# EAGLE design controller3 (EAGLE 6.3)
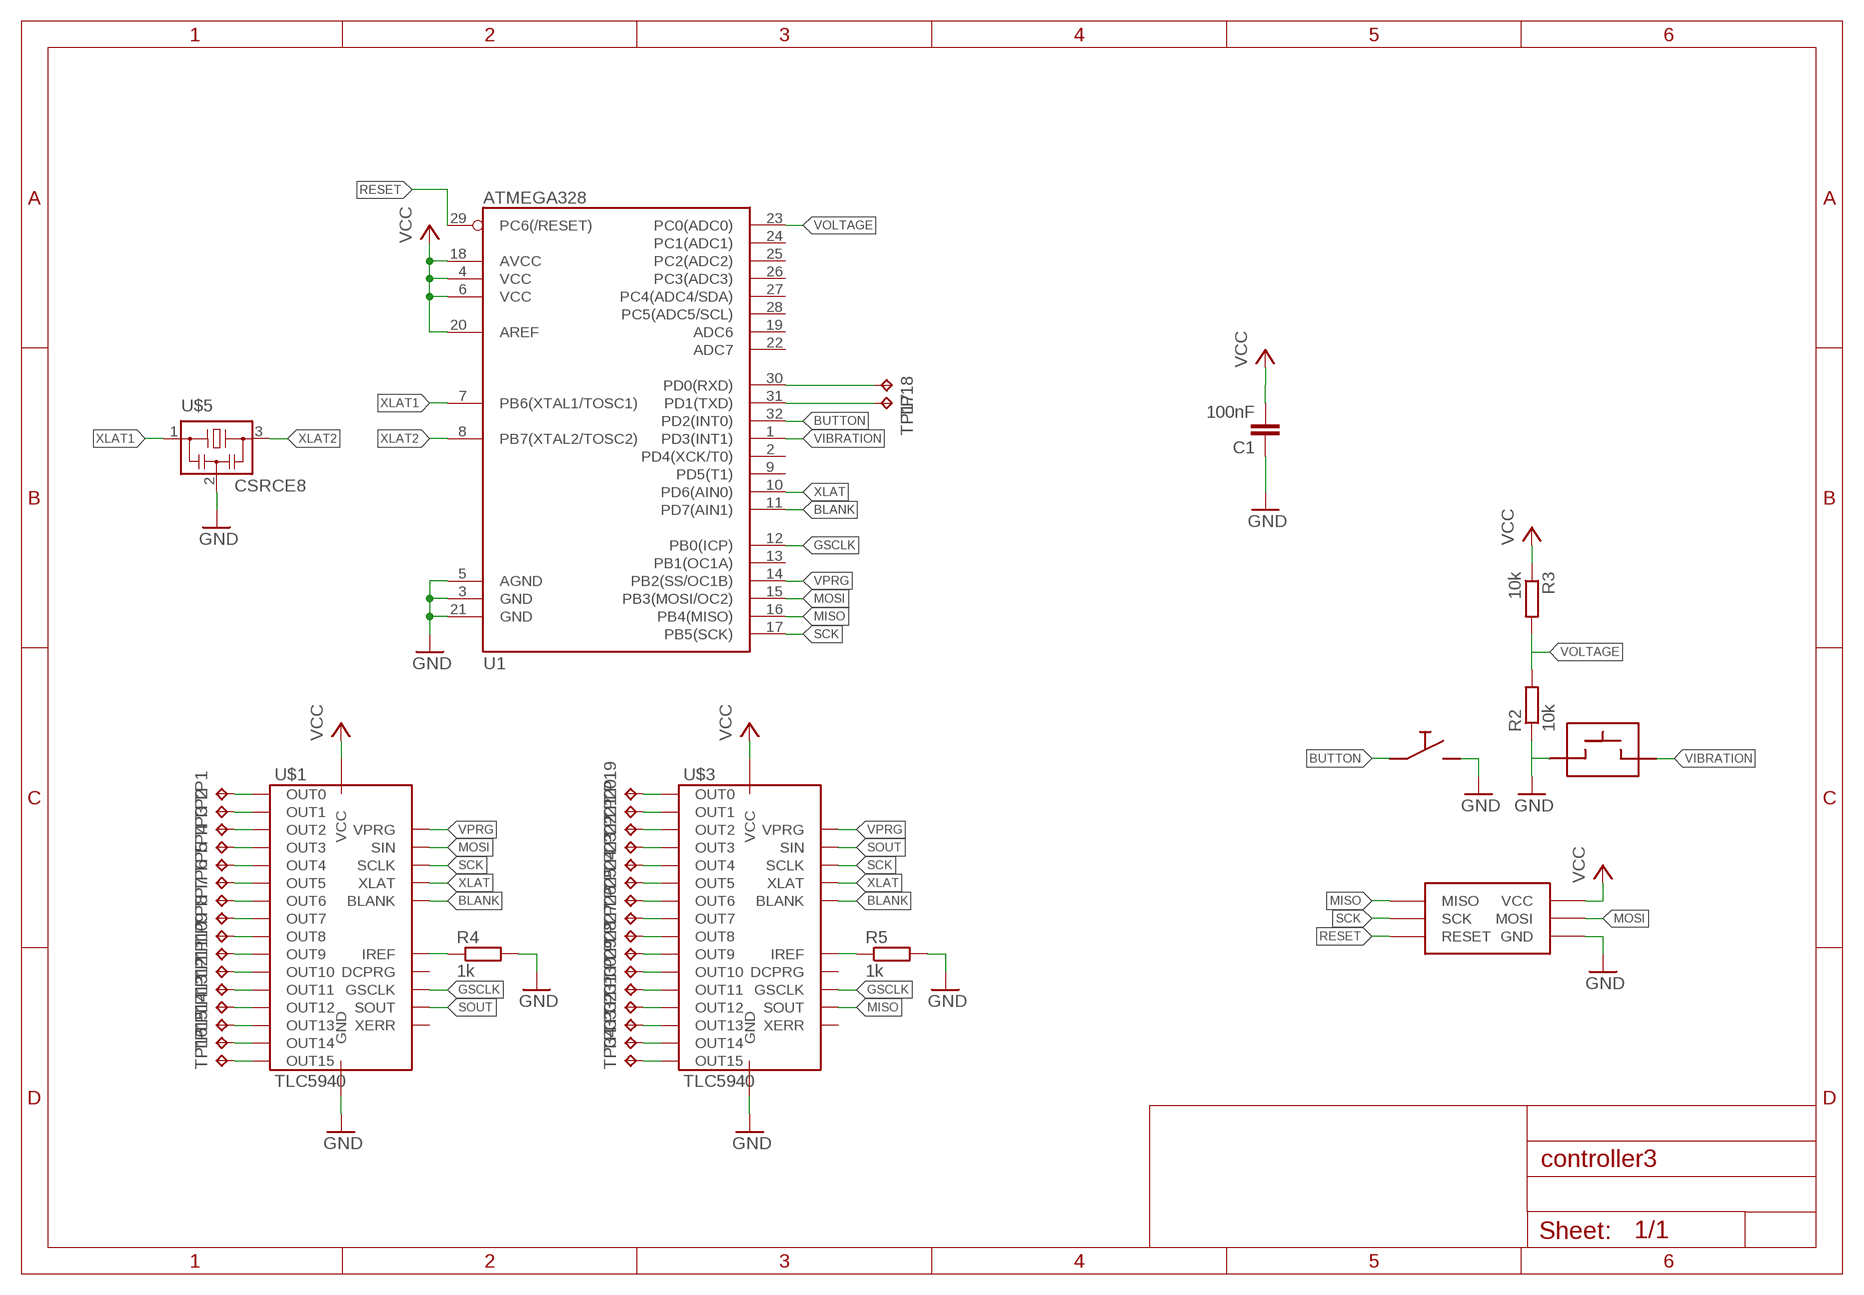
[diagram p0: schematic, sheet 1]

## Parts
C1  100nF  C-EUC0603  [C0603]
R2  10k  R-EU_R0603  [R0603]
R3  10k  R-EU_R0603  [R0603]
R4  1k  R-EU_R0603  [R0603]
R5  1k  R-EU_R0603  [R0603]
TP1  TPTP15SQ  [TP15SQ]
TP2  TPTP15SQ  [TP15SQ]
TP3  TPTP15SQ  [TP15SQ]
TP4  TPTP15SQ  [TP15SQ]
TP5  TPTP15SQ  [TP15SQ]
TP6  TPTP15SQ  [TP15SQ]
TP7  TPTP15SQ  [TP15SQ]
TP8  TPTP15SQ  [TP15SQ]
TP9  TPTP15SQ  [TP15SQ]
TP10  TPTP15SQ  [TP15SQ]
TP11  TPTP15SQ  [TP15SQ]
TP12  TPTP15SQ  [TP15SQ]
TP13  TPTP15SQ  [TP15SQ]
TP14  TPTP15SQ  [TP15SQ]
TP15  TPTP15SQ  [TP15SQ]
TP16  TPTP15SQ  [TP15SQ]
TP17  TPTP15SQ  [TP15SQ]
TP18  TPTP15SQ  [TP15SQ]
TP19  TPTP15SQ  [TP15SQ]
TP20  TPTP15SQ  [TP15SQ]
TP21  TPTP15SQ  [TP15SQ]
TP22  TPTP15SQ  [TP15SQ]
TP23  TPTP15SQ  [TP15SQ]
TP24  TPTP15SQ  [TP15SQ]
TP25  TPTP15SQ  [TP15SQ]
TP26  TPTP15SQ  [TP15SQ]
TP27  TPTP15SQ  [TP15SQ]
TP28  TPTP15SQ  [TP15SQ]
TP29  TPTP15SQ  [TP15SQ]
TP30  TPTP15SQ  [TP15SQ]
TP31  TPTP15SQ  [TP15SQ]
TP32  TPTP15SQ  [TP15SQ]
TP33  TPTP15SQ  [TP15SQ]
TP34  TPTP15SQ  [TP15SQ]
U1  ATMEGA328  [TQFP32-08]
U$1  TLC5940  [PWP_28PIN]
U$2  ISP_SPECIALS  [ISP_RM2_00_STRAIGHT]
U$3  TLC5940  [PWP_28PIN]
U$4  MOTION_SENSOR  [MOTION]
U$5  CSRCE8  [CSTCE_G]
U$6  SWITCH  [EVQPSG02K]

## Nets
BLANK: U1.11(PD7(AIN1)) U$1.P2(BLANK) U$3.P2(BLANK)
BUTTON: U1.32(PD2(INT0)) U$6.A U$6.A@2
GND: C1.1 R2.1 R4.2 R5.2 U1.3(GND) U1.5(AGND) U1.21(GND) U$1.P1(GND) U$1.P29(GND) U$2.VCC(GND) U$3.P1(GND) U$3.P29(GND) U$4.P$1(IN) U$5.2 U$6.B U$6.B@2
GSCLK: U1.12(PB0(ICP)) U$1.P25(GSCLK) U$3.P25(GSCLK)
MISO: U1.16(PB4(MISO)) U$2.RESET(MISO) U$3.P24(SOUT)
MOSI: U1.15(PB3(MOSI/OC2)) U$1.P5(SIN) U$2.MOSI
N$1: TP1.TP U$1.P7(OUT0)
N$2: TP2.TP U$1.P8(OUT1)
N$3: TP3.TP U$1.P9(OUT2)
N$5: TP4.TP U$1.P10(OUT3)
N$6: TP5.TP U$1.P11(OUT4)
N$7: TP6.TP U$1.P12(OUT5)
N$8: R4.1 U$1.P27(IREF)
N$9: TP7.TP U$1.P13(OUT6)
N$10: TP8.TP U$1.P14(OUT7)
N$11: TP9.TP U$1.P15(OUT8)
N$12: TP10.TP U$1.P16(OUT9)
N$13: TP11.TP U$1.P17(OUT10)
N$14: TP12.TP U$1.P18(OUT11)
N$15: TP13.TP U$1.P19(OUT12)
N$16: TP14.TP U$1.P20(OUT13)
N$17: TP15.TP U$1.P21(OUT14)
N$18: TP16.TP U$1.P22(OUT15)
N$19: R5.1 U$3.P27(IREF)
N$20: TP19.TP U$3.P7(OUT0)
N$21: TP20.TP U$3.P8(OUT1)
N$24: TP21.TP U$3.P9(OUT2)
N$25: TP22.TP U$3.P10(OUT3)
N$26: TP23.TP U$3.P11(OUT4)
N$27: TP24.TP U$3.P12(OUT5)
N$28: TP25.TP U$3.P13(OUT6)
N$29: TP26.TP U$3.P14(OUT7)
N$30: TP27.TP U$3.P15(OUT8)
N$31: TP28.TP U$3.P16(OUT9)
N$32: TP29.TP U$3.P17(OUT10)
N$33: TP30.TP U$3.P18(OUT11)
N$34: TP31.TP U$3.P19(OUT12)
N$35: TP32.TP U$3.P20(OUT13)
N$36: TP33.TP U$3.P21(OUT14)
N$37: TP34.TP U$3.P22(OUT15)
RESET: U1.29(PC6(/RESET)) U$2.MISO(RESET)
RX: TP18.TP U1.30(PD0(RXD))
SCK: U1.17(PB5(SCK)) U$1.P4(SCLK) U$2.SCK U$3.P4(SCLK)
SOUT: U$1.P24(SOUT) U$3.P5(SIN)
TX: TP17.TP U1.31(PD1(TXD))
VCC: C1.2 R3.1 U1.4(VCC) U1.6(VCC) U1.18(AVCC) U1.20(AREF) U$1.P28(VCC) U$2.GND(VCC) U$3.P28(VCC)
VIBRATION: U1.1(PD3(INT1)) U$4.P$2(OUT)
VOLTAGE: R2.2 R3.2 U1.23(PC0(ADC0))
VPRG: U1.14(PB2(SS/OC1B)) U$1.P6(VPRG) U$3.P6(VPRG)
XLAT: U1.10(PD6(AIN0)) U$1.P3(XLAT) U$3.P3(XLAT)
XLAT1: U1.7(PB6(XTAL1/TOSC1)) U$5.1
XLAT2: U1.8(PB7(XTAL2/TOSC2)) U$5.3
Unconnected: U1.2(PD4(XCK/T0)) U1.9(PD5(T1)) U1.13(PB1(OC1A)) U1.19(ADC6) U1.22(ADC7) U1.24(PC1(ADC1)) U1.25(PC2(ADC2)) U1.26(PC3(ADC3)) U1.27(PC4(ADC4/SDA)) U1.28(PC5(ADC5/SCL)) U$1.P23(XERR) U$1.P26(DCPRG) U$3.P23(XERR) U$3.P26(DCPRG)

## Library data of the parts
C1 = rcl:C-EU: CAPACITOR, European symbol
R2-R5 = rcl:R-EU_: RESISTOR, European symbol
TP1-TP34 = testpad:TP: Test pad
U1 = thecustomgeek:ATMEGA328: ATmega328P-AU TQFP 32 pin
U$1 U$3 = niklas:TLC5940
U$2 = bookla:ISP_SPECIAL
U$4 = bookla:MOTION_SENSOR
U$5 = bookla:CSRCE8
U$6 = bookla:SWITCH

## Board
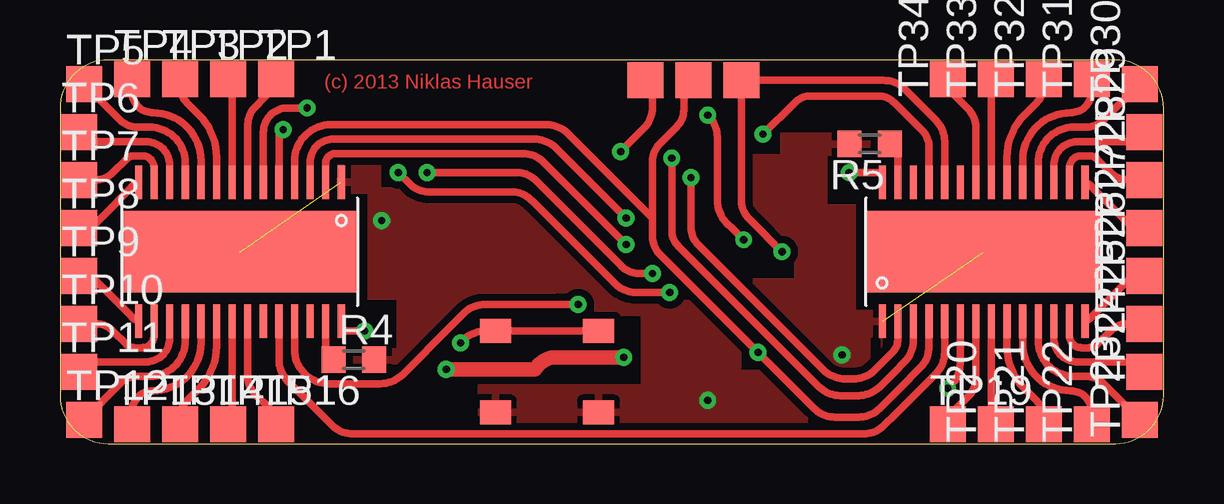
[diagram p1: board, top side]
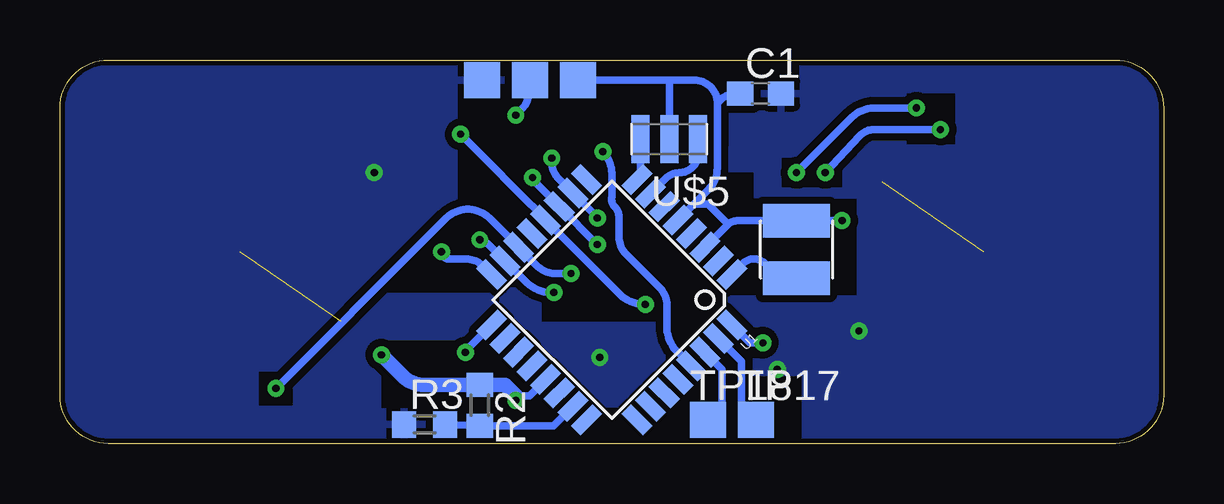
[diagram p2: board, bottom side, seen from below]

Size 46 x 16 mm. Coordinates in mm from the lower left corner, seen from the top.
Outline: 0,14 0,2 arc90 2,0 44,0 arc90 46,2 46,14 arc90 44,16 2,16 arc90 0,14
Copper layers (1*16): Top 0.035mm / dielectric 1.5mm / Bottom 0.035mm
Design rules "default *": minimum track width 10mil, minimum drill 24mil, track to track 12mil, track to pad 10mil, pad to pad 8mil, via to via 8mil, smd to smd 8mil, copper to edge 8mil, drill to drill 8mil, minimum pad ring 10mil, minimum via ring 8mil, stop-mask expansion 4mil, vias tented up to drill 0mil, thermal gap 10mil
tRestrict: area 33.2,5.6 to 43.5,10.4; area 2.4,5.6 to 12.8,10.4; area 32,10 to 34,12; area 30,13 to 35,14; area 11,4 to 14,6; area 14.4,2.5 to 21,3.3; area 21,2.5 to 24.2,5.3; area 28.1,6.9 to 30.6,8.2; area 16.9,0.8 to 17.4,2.6; area 28.7,12.1 to 30,13.5; area 13.4,10.7 to 15.9,11.9; area 28.4,3.1 to 29.6,4.3; 2 more areas
bRestrict: area 27.3,3 to 28.8,4.2; area 28.6,3.1 to 32.6,4.3; area 27.6,13 to 29.4,14.4; area 29.1,10.1 to 29.4,12.5; area 19.1,10 to 21,11.2; area 12.8,6.2 to 18.1,10.2; area 22.5,1.1 to 23.8,1.5; area 31.1,1.5 to 32.6,3.1; area 27.4,6.3 to 32.4,7.4; area 21.2,5.1 to 25.9,6.2; area 15.2,15.1 to 16.4,15.8; area 17.1,10 to 18.8,11.3; 4 more areas

### Footprints (pad centres in the part's own frame; a part is rotated, then mirrored left to right if it is on the bottom)
C0603 = smd 1.1 x 1: 1 -0.85,0; 2 0.85,0
R0603 = smd 1 x 1.1: 1 -0.85,0; 2 0.85,0
TP15SQ = smd 1.5 x 1.5: TP 0,0
TQFP32-08 = smd 1.27 x 0.559: 1 -4.293,2.8; 2 -4.293,2; 3 -4.293,1.2; 4 -4.293,0.4; 5 -4.293,-0.4; 6 -4.293,-1.2; 7 -4.293,-2; 8 -4.293,-2.8; 17 4.293,-2.8; 18 4.293,-2; 19 4.293,-1.2; 20 4.293,-0.4; 21 4.293,0.4; 22 4.293,1.2; 23 4.293,2; 24 4.293,2.8 | smd 0.559 x 1.27: 9 -2.8,-4.293; 10 -2,-4.293; 11 -1.2,-4.293; 12 -0.4,-4.293; 13 0.4,-4.293; 14 1.2,-4.293; 15 2,-4.293; 16 2.8,-4.293; 25 2.8,4.293; 26 2,4.293; 27 1.2,4.293; 28 0.4,4.293; 29 -0.4,4.293; 30 -1.2,4.293; 31 -2,4.293; 32 -2.8,4.293
PWP_28PIN = smd 0.3 x 1.4: P1 -4.225,-2.9; P2 -3.575,-2.9; P3 -2.925,-2.9; P4 -2.275,-2.9; P5 -1.625,-2.9; P6 -0.975,-2.9; P7 -0.325,-2.9; P8 0.325,-2.9; P9 0.975,-2.9; P10 1.625,-2.9; P11 2.275,-2.9; P12 2.925,-2.9; P13 3.575,-2.9; P14 4.225,-2.9; P15 4.225,2.9; P16 3.575,2.9; P17 2.925,2.9; P18 2.275,2.9; P19 1.625,2.9; P20 0.975,2.9; P21 0.325,2.9; P22 -0.325,2.9; P23 -0.975,2.9; P24 -1.625,2.9; P25 -2.275,2.9; P26 -2.925,2.9; P27 -3.575,2.9; P28 -4.225,2.9 | smd 9.7 x 3.4: P29 0,0
ISP_RM2_00_STRAIGHT = smd 1.5 x 1.5 bottom: GND 2,-0.85; MOSI 0,-0.85; VCC -2,-0.85 | smd 1.5 x 1.5: MISO -2,-0.85; RESET 2,-0.85; SCK 0,-0.85
MOTION = smd 1.4 x 2.8: P$1 -1.2,0; P$2 1.2,0
CSTCE_G = smd 0.75 x 2: 1 -1.2,0; 2 0,0; 3 1.2,0
EVQPSG02K = smd 1 x 1.3: A -1.7,2.15; A@2 -1.7,-2.15; B 1.7,2.15; B@2 1.7,-2.15

### Placement (x,y rotation side)
C1  16.8,14.6 0 bottom
R2  28.5,1.6 270 bottom
R3  30.8,0.8 0 bottom
R4  12.25,3.5 0 top
R5  33.75,12.5 180 top
TP1  9,15.2 0 top
TP2  7,15.2 0 top
TP3  5,15.2 0 top
TP4  3,15.2 0 top
TP5  1,15 0 top
TP6  0.8,13 0 top
TP7  0.8,11 0 top
TP8  0.8,9 0 top
TP9  0.8,7 0 top
TP10  0.8,5 0 top
TP11  0.8,3 0 top
TP12  1,1 0 top
TP13  3,0.8 0 top
TP14  5,0.8 0 top
TP15  7,0.8 0 top
TP16  9,0.8 0 top
TP17  17,1 0 bottom
TP18  19,1 0 bottom
TP19  37,0.8 0 top
TP20  39,0.8 90 top
TP21  41,0.8 90 top
TP22  43,0.8 90 top
TP23  45,1 90 top
TP24  45.2,3 90 top
TP25  45.2,5 90 top
TP26  45.2,7 90 top
TP27  45.2,9 90 top
TP28  45.2,11 90 top
TP29  45.2,13 90 top
TP30  45,15 90 top
TP31  43,15.2 90 top
TP32  41,15.2 90 top
TP33  39,15.2 90 top
TP34  37,15.2 90 top
U1  23,6 225 bottom
U$1  7.5,8 180 top
U$2  26.4,16 0 top
U$3  38.5,8 0 top
U$4  15.3,8.1 270 bottom
U$5  20.6,12.7 180 bottom
U$6  20.3,3 270 top

### Tracks (layer width: path | path; a pad name or v marks a point on that pad's centre or on a via)
BLANK  (via drill 0.3)
  Top 0.305: U$3.P2 34.92,4.34 arc-45 34.7,3.8 33.97,3.07 arc-45 33.07,2.7 33,2.7 32.73,2.7 arc-45 31.83,3.07 26.59,8.31 arc-45 26.3,9.01 v26.3,11.1 | U$1.P2 11.07,11.68 arc-90 11.5,12.1 19.27,12.1 arc-45 20.17,11.73 v23.6,8.3
  Bottom 0.305: v26.3,11.1 arc-45 26.23,10.92 25.83,10.53 U1.11 v23.61,8.3 arc-45 v23.6,8.3
BUTTON  (via drill 0.3)
  Top 0.305: U$6.A U$6.A@2 17.73,4.7 arc45 16.83,4.33 v16.7,4.2
  Bottom 0.305: v16.7,4.2 17.24,4.2 U1.32
GND  (via drill 0.3)  (2 unrouted)
  Bottom 0.305: U1.21 26.43,2 27,2 v27,1.8 | 18.2,9.1 U1.3 | U1.5 19.57,10 | 19.57,10 19,10 18.2,9.2 18.2,9.1 | v13.4,9.3 14.31,9.29 arc45 14.61,9.3 U$4.P$1 17.48,9.3 17.72,9.3 arc-45 18.2,9.1 | U$2.VCC 21.35,15.15 20.5,15.15 | U$5.2 20.6,14.4 20.6,15.05 arc90 20.5,15.15 | 19.57,10 18.97,10.59 arc-45 18.6,11.49 18.6,12.4 18.6,14.2 | 20.5,15.15 19.55,15.15 arc90 18.6,14.2 | C1.1 17.79,14.6 arc-45 18.49,14.31 18.6,14.2
  Bottom 0.61: 27,2 27.45,2.45 R2.1 30.82,2.45 arc45 31.72,2.82 v32.6,3.7
  pour Top: 0,16 46,16 46,0 0,0
GSCLK  (via drill 0.3)
  Top 0.305: U$3.P25 36.23,12.36 arc45 35.93,13.07 35,14 34.79,14.21 arc45 34.09,14.5 31.31,14.5 arc45 30.61,14.21 v29.3,12.9 | U$1.P25 9.78,3.92 arc90 11.2,2.5 13.37,2.5 arc45 14.27,2.87 16.3,4.9 16.73,5.33 arc-45 17.63,5.8 20.7,5.8 | 20.7,5.8 21.17,5.8 | 21.17,5.8 20.7,5.8 | 20.7,5.8 21.17,5.8 | v21.6,5.8 21.17,5.8
  Bottom 0.305: v29.3,12.9 28.2,11.8 26.9,10.5 25.78,9.38 arc45 U1.12 23.22,6.78 22.64,6.21 arc-45 v21.6,5.8
MISO  (via drill 0.3)
  Top 0.305: U$3.P24 36.88,12.6 arc45 36.5,13.5 36,14 35.22,14.78 arc45 34.32,15.15 U$2.RESET 28.4,10.11 arc45 28.79,9.31 v30.1,8
  Bottom 0.305: v30.1,8 arc-90 29.8,7.7 29.07,7.7 arc45 28.37,7.41 U1.16
MOSI  (via drill 0.3)
  Top 0.305: v28.5,8.5 27.97,9.03 arc-45 27.4,10.03 27.4,12.77 arc45 27.03,13.67 v27,13.7 | U$1.P5 9.12,11.82 9.12,12.68 arc-45 v9.3,13.1 | v14.1,11.3 14.61,10.79 arc45 15.41,10.5 15.5,10.5 18.89,10.5 arc-45 19.69,10.11 23.13,6.67 arc45 24.03,6.3 v25.41,6.3
  Bottom 0.305: v28.5,8.5 arc-45 28.18,8.35 U1.15 26.52,6.69 arc-45 v25.41,6.3 | v27,13.7 26.77,13.93 arc-45 26.4,14.93 U$2.MOSI | v14.1,11.3 12.67,12.83 arc45 12.07,13.1 v9.3,13.1
N$1
  Top 0.305: U$1.P7 7.83,13.21 arc-45 8.12,14.02 8.56,14.46 8.85,14.75 arc45 9,15.01 TP1.TP
N$2
  Top 0.305: U$1.P8 7.17,14.82 TP2.TP
N$3
  Top 0.305: U$1.P9 6.53,11.94 arc45 5.79,13.71 5.29,14.21 arc-45 5,14.91 TP3.TP
N$5
  Top 0.305: 3,14.81 TP4.TP 3,14.68 arc90 3.88,13.8 arc-90 5.88,11.8 U$1.P10
N$6
  Top 0.305: TP5.TP 2.51,13.49 arc45 3.21,13.2 3.73,13.2 arc-90 5.22,11.7 U$1.P11
N$7
  Top 0.305: TP6.TP 1.4,12.6 3.58,12.6 arc-90 4.58,11.6 U$1.P12
N$8
  Top 0.305: U$1.P27 11.07,3.77 R4.1
N$9
  Top 0.305: TP7.TP 1.49,11 arc45 2.19,11.29 2.75,11.85 arc-45 3.11,12 3.42,12 arc-90 3.92,11.5 U$1.P13
N$10
  Top 0.305: U$1.P14 arc45 2.98,10.68 1.79,9.49 1.3,9 TP8.TP
N$11
  Top 0.305: U$1.P15 arc-45 2.98,5.32 1.59,6.71 1.3,7 TP9.TP 0.89,7
N$12
  Top 0.305: TP10.TP 1.49,5 arc-45 2.19,4.71 2.75,4.15 arc45 3.11,4 3.42,4 arc90 3.92,4.5 U$1.P16
N$13
  Top 0.305: TP11.TP 1.4,3.4 3.58,3.4 arc90 4.58,4.4 U$1.P17
N$14
  Top 0.305: TP12.TP 2.51,2.51 arc-45 3.21,2.8 3.73,2.8 arc90 5.22,4.3 U$1.P18
N$15
  Top 0.305: 3,1.19 TP13.TP 3,1.32 arc-90 3.88,2.2 arc90 5.88,4.2 U$1.P19
N$16
  Top 0.305: U$1.P20 6.53,4.06 arc-45 5.79,2.29 5.29,1.79 arc45 5,1.09 TP14.TP
N$17
  Top 0.305: U$1.P21 7.17,1.18 TP15.TP
N$18
  Top 0.305: U$1.P22 7.83,2.79 arc45 8.12,2.08 8.72,1.48 arc-45 TP16.TP
N$19
  Top 0.305: U$3.P27 34.92,12.28 R5.1
N$20
  Top 0.305: U$3.P7 38.17,2.69 arc-45 37.88,1.98 37.54,1.64 37,1.1 TP19.TP
N$21
  Top 0.305: U$3.P8 38.83,1.18 TP20.TP
N$24
  Top 0.305: U$3.P9 39.48,4.06 arc45 40.21,2.29 40.71,1.79 arc-45 41,1.09 TP21.TP
N$25
  Top 0.305: 43,1.19 TP22.TP 43,1.32 arc90 42.12,2.2 arc-90 40.12,4.2 U$3.P10
N$26
  Top 0.305: TP23.TP 43.49,2.51 arc45 42.79,2.8 42.27,2.8 arc-90 40.77,4.3 U$3.P11
N$27
  Top 0.305: TP24.TP 44.6,3.4 42.42,3.4 arc-90 41.42,4.4 U$3.P12
N$28
  Top 0.305: TP25.TP 44.51,5 arc45 43.81,4.71 43.25,4.15 arc-45 42.89,4 42.58,4 arc-90 42.08,4.5 U$3.P13
N$29
  Top 0.305: U$3.P14 arc45 43.02,5.32 44.3,6.6 44.7,7 TP26.TP
N$30
  Top 0.305: U$3.P15 arc-45 43.02,10.68 44.4,9.3 44.41,9.29 44.7,9 TP27.TP 45.11,9
N$31
  Top 0.305: TP28.TP 44.51,11 arc-45 43.81,11.29 43.25,11.85 arc45 42.89,12 42.58,12 arc90 42.08,11.5 U$3.P16
N$32
  Top 0.305: TP29.TP 44.6,12.6 42.42,12.6 arc90 41.42,11.6 U$3.P17
N$33
  Top 0.305: TP30.TP 43.49,13.49 arc-45 42.79,13.2 42.27,13.2 arc90 40.77,11.7 U$3.P18
N$34
  Top 0.305: 43,14.81 TP31.TP 43,14.68 arc-90 42.12,13.8 arc90 40.12,11.8 U$3.P19
N$35
  Top 0.305: 41,14.91 TP32.TP 41,14.91 | U$3.P20 39.48,11.94 arc-45 40.21,13.71 40.71,14.21 arc45 41,14.91
N$36
  Top 0.305: U$3.P21 38.83,14.82 TP33.TP
N$37
  Top 0.305: U$3.P22 38.17,13.21 arc45 37.88,13.92 37.44,14.36 37.15,14.65 arc-45 37,15.01 TP34.TP
RESET  (via drill 0.3)
  Top 0.305: v23.37,12.17 24.33,13.13 arc45 24.7,14.03 24.7,14.43 arc45 U$2.MISO
  Bottom 0.305: U1.29 20.23,3.79 arc45 20.7,4.79 20.7,5.79 arc-45 20.99,6.49 21.4,6.9 22.41,7.91 arc45 22.7,8.61 22.7,8.8 22.7,9.46 arc-45 22.9,9.9 arc45 23,10.28 23,10.9 23,11.27 arc-45 v23.37,12.17
RX
  Bottom 0.305: U1.30 18.4,3.1 18.4,1.9 18.4,1.6 TP18.TP
SCK  (via drill 0.3)
  Top 0.305: U$3.P4 36.23,4.05 arc-45 35.85,3.15 35,2.3 34.17,1.47 arc-45 33.27,1.1 32.33,1.1 arc-45 31.43,1.47 v29.1,3.8 24.99,7.91 arc-45 24.7,8.61 24.7,9.4 | U$2.SCK arc-90 26.15,14.9 26,14.9 26,13.91 arc-45 25.71,13.21 25.3,12.8 24.99,12.49 arc45 24.7,11.79 24.7,11.6 24.7,9.6 24.7,9.4 | U$1.P4 9.78,11.78 arc-90 11.3,13.3 20.27,13.3 arc-45 21.17,12.93 24.7,9.4
  Bottom 0.305: v29.1,3.8 arc45 29.06,3.9 U1.17
SOUT
  Top 0.305: U$1.P24 9.12,3.88 9.12,3.5 arc45 9.5,2.6 9.8,2.3 11.33,0.77 arc45 12.23,0.4 15.93,0.4 33.2,0.4 33.47,0.4 arc45 34.37,0.77 34.8,1.2 36.5,2.9 arc45 36.88,3.8 U$3.P5
TX
  Bottom 0.305: U1.31 17.6,3.43 17.6,1.5 17.1,1 TP17.TP
VCC  (via drill 0.3)
  Top 0.305: U$3.P28 34.27,11.3 v32.9,11.3 | U$1.P28 11.72,4.7 v12.7,4.7
  Top 0.61: v23.5,3.6 20.52,3.6 arc45 19.8,3.1 v16.1,3.1
  pour Bottom: 0,16 46,16 46,0 0,0
VIBRATION
  Bottom 0.305: U1.1 17.51,7.53 arc45 17.1,7.7 arc45 16.59,7.49 16.3,7.2 16.02,7.2 arc45 U$4.P$2
VOLTAGE
  Bottom 0.305: R3.2 R2.2 25.42,0.75 U1.23
VPRG  (via drill 0.3)
  Top 0.305: U$3.P6 37.52,3.35 arc-45 37.15,2.45 v37,2.3 | U$1.P6 8.47,12.76 8.47,12.97 arc-90 9.5,14 v10.3,14 | v15.3,11.3 19.09,11.3 arc-45 19.79,11.01 23.4,7.4 | 23.4,7.4 23.41,7.39 | 23.41,7.39 23.4,7.4 | 23.4,7.4 23.41,7.39 | 23.41,7.39 arc45 24.11,7.1 v24.7,7.1
  Bottom 0.305: v37,2.3 30.67,8.63 29.9,9.4 arc90 28.1,9.4 U1.14 arc-45 U1.14 26.09,7.39 arc-45 25.38,7.1 v24.7,7.1 | v10.3,14 12.07,14 | 12.07,14 12.09,14 12.07,14 | 12.07,14 arc-45 13.07,13.53 v15.3,11.3
XLAT  (via drill 0.3)
  Top 0.305: U$3.P3 35.58,4.3 arc-45 35.2,3.4 34.8,3 34.17,2.37 arc-45 33.27,2 | 33.27,2 33.3,2 33.27,2 | 33.27,2 32.53,2 arc-45 31.63,2.37 25.79,8.21 arc-45 25.5,8.91 v25.5,11.9 | U$1.P3 10.43,11.72 arc-90 11.4,12.7 19.77,12.7 arc-45 20.67,12.33 v23.6,9.4
  Bottom 0.305: v25.5,11.9 25.5,11.74 arc-45 25.21,11.04 U1.10 23.59,9.42 arc-45 v23.6,9.4
XLAT1
  Bottom 0.305: U1.7 20.79,11.04 arc45 20.1,11.3 arc-90 19.4,12.2 U$5.1
XLAT2
  Bottom 0.305: U$5.3 21.8,11.36 arc45 U1.8

### Text on the board
Top: (c) 2013 Niklas Hauser